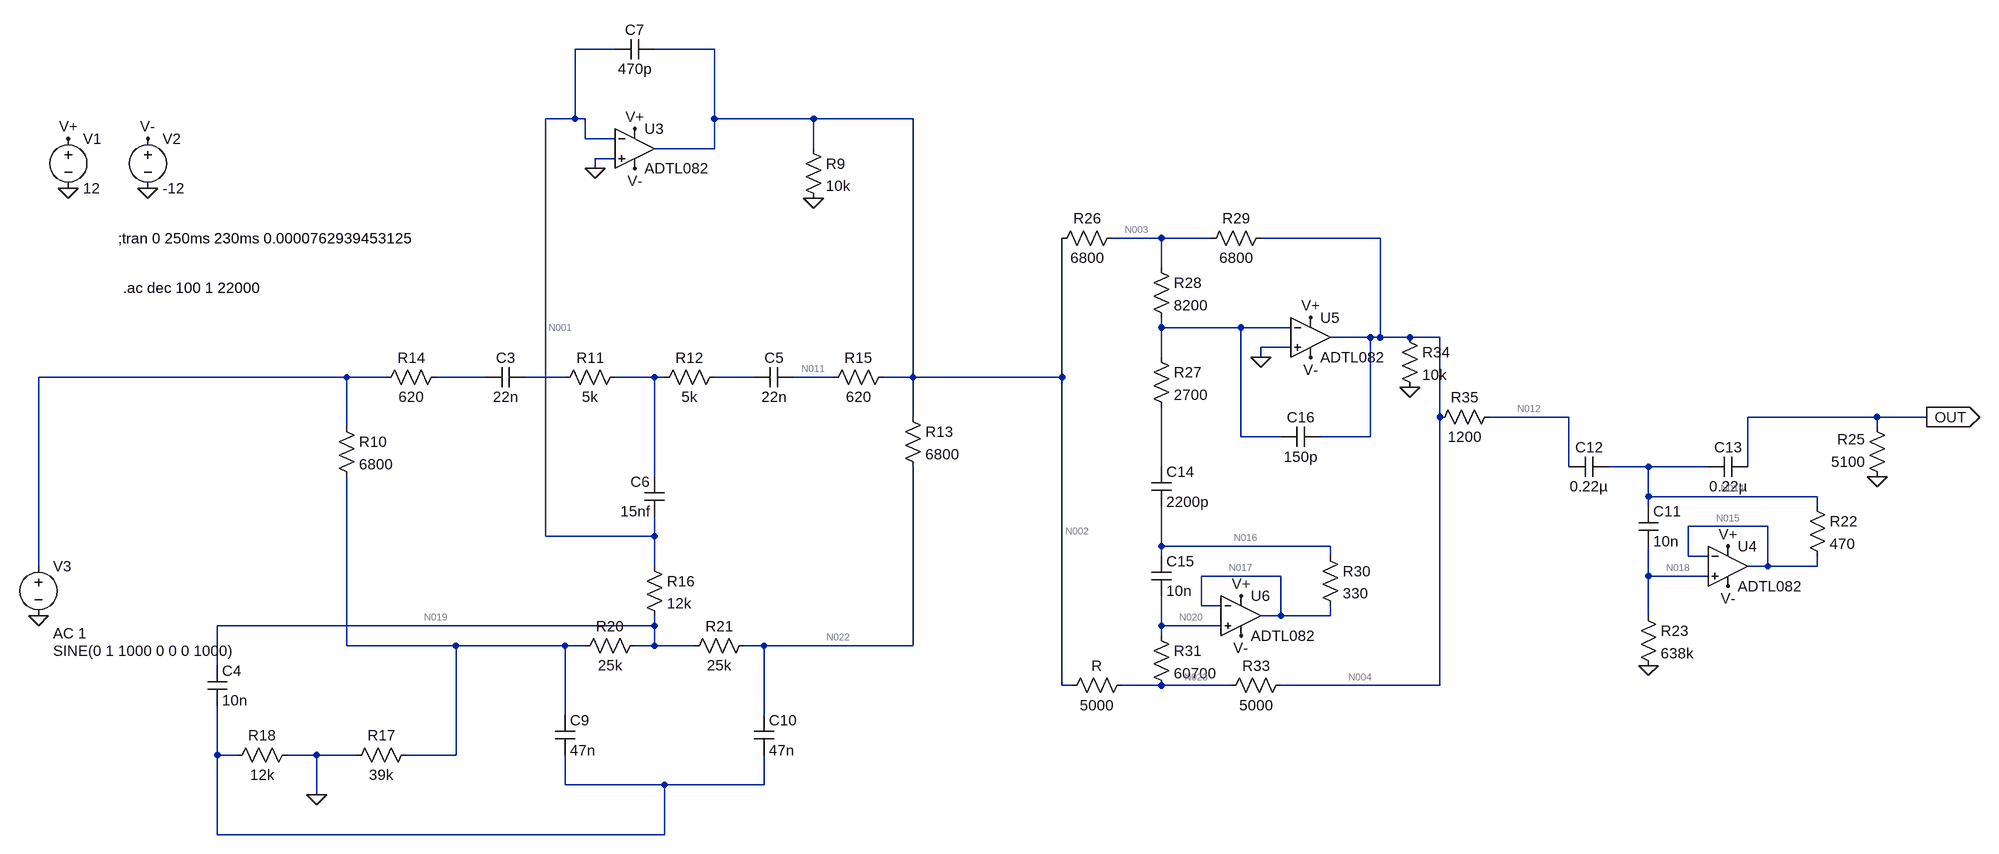
[diagram p0: schematic NYAN_1073.asc]
NYAN_1073.asc, the LTspice schematic file:
Version 4
SHEET 1 1724 2576
WIRE -1136 -144 -1200 -144
WIRE -976 -144 -1072 -144
WIRE -1200 -32 -1200 -144
WIRE -1200 -32 -1248 -32
WIRE -1184 -32 -1200 -32
WIRE -976 -32 -976 -144
WIRE -816 -32 -976 -32
WIRE -656 -32 -816 -32
WIRE -1184 0 -1184 -32
WIRE -1136 0 -1184 0
WIRE -976 16 -976 -32
WIRE -976 16 -1072 16
WIRE -816 16 -816 -32
WIRE -1136 32 -1168 32
WIRE -1168 48 -1168 32
WIRE -256 160 -336 160
WIRE -176 160 -256 160
WIRE 96 160 -96 160
WIRE -256 208 -256 160
WIRE -256 304 -256 288
WIRE -128 304 -256 304
WIRE -48 304 -128 304
WIRE 80 320 16 320
WIRE 96 320 96 160
WIRE 96 320 80 320
WIRE 144 320 96 320
WIRE 192 320 144 320
WIRE -48 336 -96 336
WIRE -256 352 -256 304
WIRE -96 352 -96 336
WIRE -1568 384 -2064 384
WIRE -1504 384 -1568 384
WIRE -1344 384 -1424 384
WIRE -1216 384 -1280 384
WIRE -1072 384 -1136 384
WIRE -1056 384 -1072 384
WIRE -912 384 -976 384
WIRE -784 384 -848 384
WIRE -656 384 -656 -32
WIRE -656 384 -704 384
WIRE -416 384 -416 160
WIRE -416 384 -656 384
WIRE -656 448 -656 384
WIRE 192 448 192 320
WIRE 400 448 272 448
WIRE 896 448 688 448
WIRE 976 448 896 448
WIRE -1568 464 -1568 384
WIRE 896 464 896 448
WIRE -128 480 -128 304
WIRE -64 480 -128 480
WIRE 80 480 80 320
WIRE 80 480 0 480
WIRE -256 528 -256 432
WIRE 400 528 400 448
WIRE 528 528 464 528
WIRE 624 528 528 528
WIRE 688 528 688 448
WIRE -1072 544 -1072 384
WIRE 528 576 528 528
WIRE 800 576 528 576
WIRE 528 592 528 576
WIRE 800 592 800 576
WIRE 720 624 592 624
WIRE -1248 640 -1248 -32
WIRE -1072 640 -1072 608
WIRE -1072 640 -1248 640
WIRE -256 656 -256 592
WIRE 16 656 -256 656
WIRE -256 672 -256 656
WIRE 16 672 16 656
WIRE 592 672 592 624
WIRE 624 672 592 672
WIRE -2064 688 -2064 384
WIRE -1072 688 -1072 640
WIRE 720 688 720 624
WIRE 720 688 688 688
WIRE 800 688 800 672
WIRE 800 688 720 688
WIRE -64 704 -192 704
WIRE 528 704 528 656
WIRE 624 704 528 704
WIRE -192 752 -192 704
WIRE -160 752 -192 752
WIRE -64 768 -64 704
WIRE -64 768 -96 768
WIRE 16 768 16 752
WIRE 16 768 -64 768
WIRE 528 768 528 704
WIRE -1072 784 -1072 768
WIRE -1072 784 -1776 784
WIRE -256 784 -256 736
WIRE -160 784 -256 784
WIRE -256 800 -256 784
WIRE -1568 816 -1568 544
WIRE -1392 816 -1568 816
WIRE -1216 816 -1392 816
WIRE -1184 816 -1216 816
WIRE -1072 816 -1072 784
WIRE -1072 816 -1104 816
WIRE -1008 816 -1072 816
WIRE -896 816 -928 816
WIRE -656 816 -656 528
WIRE -656 816 -896 816
WIRE -1776 848 -1776 784
WIRE -416 880 -416 384
WIRE -400 880 -416 880
WIRE -256 880 -320 880
WIRE -144 880 -256 880
WIRE 192 880 192 448
WIRE 192 880 -64 880
WIRE -1216 928 -1216 816
WIRE -896 928 -896 816
WIRE -1776 992 -1776 912
WIRE -1744 992 -1776 992
WIRE -1616 992 -1664 992
WIRE -1552 992 -1616 992
WIRE -1392 992 -1392 816
WIRE -1392 992 -1472 992
WIRE -1216 1040 -1216 992
WIRE -1056 1040 -1216 1040
WIRE -896 1040 -896 992
WIRE -896 1040 -1056 1040
WIRE -1616 1056 -1616 992
WIRE -1776 1120 -1776 992
WIRE -1056 1120 -1056 1040
WIRE -1056 1120 -1776 1120
FLAG -2016 80 0
FLAG 976 448 OUT
IOPIN 976 448 Out
FLAG -2016 0 V+
FLAG -1888 80 0
FLAG -1888 0 V-
FLAG -2064 768 0
FLAG -1168 48 0
FLAG -1104 -16 V+
FLAG -1104 48 V-
FLAG -1616 1056 0
FLAG -816 96 0
FLAG 656 656 V+
FLAG 656 720 V-
FLAG 528 848 0
FLAG 896 544 0
FLAG -96 352 0
FLAG -16 288 V+
FLAG -128 736 V+
FLAG -16 352 V-
FLAG -128 800 V-
FLAG 144 400 0
SYMBOL voltage -2016 -16 R0
WINDOW 123 0 0 Left 0
WINDOW 39 0 0 Left 0
SYMATTR InstName V1
SYMATTR Value 12
SYMBOL voltage -1888 -16 R0
WINDOW 123 0 0 Left 0
WINDOW 39 0 0 Left 0
SYMATTR InstName V2
SYMATTR Value -12
SYMBOL voltage -2064 672 R0
WINDOW 3 24 152 Left 2
WINDOW 123 24 124 Left 2
WINDOW 39 0 0 Left 0
SYMATTR Value SINE(0 1 1000 0 0 0 1000)
SYMATTR Value2 AC 1
SYMATTR InstName V3
SYMBOL res -1120 368 R90
WINDOW 0 0 56 VBottom 2
WINDOW 3 32 56 VTop 2
SYMATTR InstName R11
SYMATTR Value 5k
SYMBOL res -960 368 R90
WINDOW 0 0 56 VBottom 2
WINDOW 3 32 56 VTop 2
SYMATTR InstName R12
SYMATTR Value 5k
SYMBOL Opamps\\ADTL082 -1104 -48 R0
SYMATTR InstName U3
SYMBOL cap -1280 368 R90
WINDOW 0 0 32 VBottom 2
WINDOW 3 32 32 VTop 2
SYMATTR InstName C3
SYMATTR Value 22n
SYMBOL cap -848 368 R90
WINDOW 0 0 32 VBottom 2
WINDOW 3 32 32 VTop 2
SYMATTR InstName C5
SYMATTR Value 22n
SYMBOL cap -1056 608 R180
WINDOW 0 24 56 Left 2
WINDOW 3 24 8 Left 2
SYMATTR InstName C6
SYMATTR Value 15nf
SYMBOL res -1584 448 R0
SYMATTR InstName R10
SYMATTR Value 6800
SYMATTR SpiceLine tol=1 pwr=0.25
SYMBOL res -672 432 R0
SYMATTR InstName R13
SYMATTR Value 6800
SYMBOL res -1408 368 R90
WINDOW 0 0 56 VBottom 2
WINDOW 3 32 56 VTop 2
SYMATTR InstName R14
SYMATTR Value 620
SYMBOL res -688 368 R90
WINDOW 0 0 56 VBottom 2
WINDOW 3 32 56 VTop 2
SYMATTR InstName R15
SYMATTR Value 620
SYMBOL res -1088 672 R0
SYMATTR InstName R16
SYMATTR Value 12k
SYMBOL res -1456 976 R90
WINDOW 0 0 56 VBottom 2
WINDOW 3 32 56 VTop 2
SYMATTR InstName R17
SYMATTR Value 39k
SYMBOL res -1648 976 R90
WINDOW 0 0 56 VBottom 2
WINDOW 3 32 56 VTop 2
SYMATTR InstName R18
SYMATTR Value 12k
SYMBOL cap -1792 848 R0
SYMATTR InstName C4
SYMATTR Value 10n
SYMBOL cap -1072 -160 R90
WINDOW 0 0 32 VBottom 2
WINDOW 3 32 32 VTop 2
SYMATTR InstName C7
SYMATTR Value 470p
SYMBOL res -832 0 R0
SYMATTR InstName R9
SYMATTR Value 10k
SYMBOL res -1088 800 R90
WINDOW 0 0 56 VBottom 2
WINDOW 3 32 56 VTop 2
SYMATTR InstName R20
SYMATTR Value 25k
SYMBOL res -912 800 R90
WINDOW 0 0 56 VBottom 2
WINDOW 3 32 56 VTop 2
SYMATTR InstName R21
SYMATTR Value 25k
SYMBOL cap -1232 928 R0
SYMATTR InstName C9
SYMATTR Value 47n
SYMBOL cap -912 928 R0
SYMATTR InstName C10
SYMATTR Value 47n
SYMBOL Opamps\\ADTL082 656 624 R0
SYMATTR InstName U4
SYMBOL cap 512 592 R0
SYMATTR InstName C11
SYMATTR Value 10n
SYMATTR SpiceLine V=63
SYMBOL res 784 576 R0
SYMATTR InstName R22
SYMATTR Value 470
SYMATTR SpiceLine tol=1 pwr=0.25
SYMBOL res 512 752 R0
SYMATTR InstName R23
SYMATTR Value 638k
SYMATTR SpiceLine tol=1 pwr=0.25
SYMBOL res 912 560 R180
WINDOW 0 36 76 Left 2
WINDOW 3 36 40 Left 2
SYMATTR InstName R25
SYMATTR Value 5100
SYMBOL cap 464 512 R90
WINDOW 0 0 32 VBottom 2
WINDOW 3 32 32 VTop 2
SYMATTR InstName C12
SYMATTR Value 0.22µ
SYMBOL cap 688 512 R90
WINDOW 0 0 32 VBottom 2
WINDOW 3 32 32 VTop 2
SYMATTR InstName C13
SYMATTR Value 0.22µ
SYMBOL Opamps\\ADTL082 -16 256 R0
SYMATTR InstName U5
SYMBOL Opamps\\ADTL082 -128 704 R0
SYMATTR InstName U6
SYMBOL res -320 144 R90
WINDOW 0 0 56 VBottom 2
WINDOW 3 32 56 VTop 2
SYMATTR InstName R26
SYMATTR Value 6800
SYMATTR SpiceLine tol=1 pwr=0.25
SYMBOL res -272 336 R0
SYMATTR InstName R27
SYMATTR Value 2700
SYMATTR SpiceLine tol=1 pwr=0.25
SYMBOL res -272 192 R0
SYMATTR InstName R28
SYMATTR Value 8200
SYMATTR SpiceLine tol=1 pwr=0.25
SYMBOL cap -272 528 R0
SYMATTR InstName C14
SYMATTR Value 2200p
SYMATTR SpiceLine V=63
SYMBOL cap -272 672 R0
SYMATTR InstName C15
SYMATTR Value 10n
SYMATTR SpiceLine V=63
SYMBOL res -80 144 R90
WINDOW 0 0 56 VBottom 2
WINDOW 3 32 56 VTop 2
SYMATTR InstName R29
SYMATTR Value 6800
SYMATTR SpiceLine tol=1 pwr=0.25
SYMBOL res 0 656 R0
SYMATTR InstName R30
SYMATTR Value 330
SYMATTR SpiceLine tol=1 pwr=0.25
SYMBOL res -272 784 R0
SYMATTR InstName R31
SYMATTR Value 60700
SYMATTR SpiceLine tol=1 pwr=0.25
SYMBOL res -304 864 R90
WINDOW 0 0 56 VBottom 2
WINDOW 3 32 56 VTop 2
SYMATTR InstName R
SYMATTR Value 5000
SYMATTR SpiceLine tol=1 pwr=0.25
SYMBOL res -48 864 R90
WINDOW 0 0 56 VBottom 2
WINDOW 3 32 56 VTop 2
SYMATTR InstName R33
SYMATTR Value 5000
SYMATTR SpiceLine tol=1 pwr=0.25
SYMBOL res 128 304 R0
SYMATTR InstName R34
SYMATTR Value 10k
SYMBOL cap 0 464 R90
WINDOW 0 0 32 VBottom 2
WINDOW 3 32 32 VTop 2
SYMATTR InstName C16
SYMATTR Value 150p
SYMBOL res 288 432 R90
WINDOW 0 0 56 VBottom 2
WINDOW 3 32 56 VTop 2
SYMATTR InstName R35
SYMATTR Value 1200
TEXT -1928 240 Left 2 !.ac dec 100 1 22000
TEXT -1936 160 Left 2 !;tran 0 250ms 230ms 0.0000762939453125

The netlist it stands for:
* NYAN_1073.asc
V1 V+ 0 12
V2 V- 0 -12
V3 N006 0 SINE(0 1 1000 0 0 0 1000) AC 1
R11 N009 N008 5k
R12 N010 N009 5k
XU3 0 N001 V+ V- N002 ADTL082  ; pins In+ In- V+ V- OUT
C3 N008 N007 22n
C5 N011 N010 22n
C6 N001 N009 15nf
R10 N006 N021 6800 tol=1 pwr=0.25
R13 N002 N022 6800
R14 N007 N006 620
R15 N002 N011 620
R16 N001 N019 12k
R17 N021 0 39k
R18 0 N024 12k
C4 N019 N024 10n
C7 N002 N001 470p
R9 N002 0 10k
R20 N019 N021 25k
R21 N022 N019 25k
C9 N021 N024 47n
C10 N022 N024 47n
XU4 N018 N015 V+ V- N015 ADTL082  ; pins In+ In- V+ V- OUT
C11 N014 N018 10n V=63
R22 N014 N015 470 tol=1 pwr=0.25
R23 N018 0 638k tol=1 pwr=0.25
R25 0 OUT 5100
C12 N014 N012 0.22µ
C13 OUT N014 0.22µ
XU5 0 N005 V+ V- N004 ADTL082  ; pins In+ In- V+ V- OUT
XU6 N020 N017 V+ V- N017 ADTL082  ; pins In+ In- V+ V- OUT
R26 N003 N002 6800 tol=1 pwr=0.25
R27 N005 N013 2700 tol=1 pwr=0.25
R28 N003 N005 8200 tol=1 pwr=0.25
C14 N013 N016 2200p V=63
C15 N016 N020 10n V=63
R29 N004 N003 6800 tol=1 pwr=0.25
R30 N016 N017 330 tol=1 pwr=0.25
R31 N020 N023 60700 tol=1 pwr=0.25
R N023 N002 5000 tol=1 pwr=0.25
R33 N004 N023 5000 tol=1 pwr=0.25
R34 N004 0 10k
C16 N004 N005 150p
R35 N012 N004 1200
.ac dec 100 1 22000
;tran 0 250ms 230ms 0.0000762939453125
.lib ADI.lib
.backanno
.end

* Results of the author's LTspice run, read from the files saved beside the schematic
* Operating Point, zero values left out:
*   V(v+) = 12 V
*   V(v-) = -12 V
*   V(n002) = 112.4 nV
*   V(n011) = 112.4 nV
*   V(n022) = 93.49 nV
*   V(n019) = 24 nV
*   V(n015) = -1.276 µV
*   V(n018) = -1.276 µV
*   V(n014) = -1.276 µV
*   V(n012) = -65.99 nV
*   V(n004) = -65.99 nV
*   V(n017) = -103.2 nV
*   V(n020) = -103.2 nV
*   V(n003) = 16.4 nV
*   V(n016) = -103.2 nV
*   V(n023) = 18.2 nV
*   I(R34) = -6.599 pA
*   I(R33) = -16.84 pA
*   I(R) = -18.84 pA
*   I(R31) = -2 pA
*   I(R29) = -12.12 pA
*   I(R28) = 2 pA
*   I(R26) = -14.12 pA
*   I(R23) = -2 pA
*   I(R21) = 2.779 pA
*   I(R9) = 11.24 pA
*   I(R16) = -2 pA
*   I(R13) = 2.779 pA
*   I(V2) = 20.22 mA
*   I(V1) = -20.22 mA
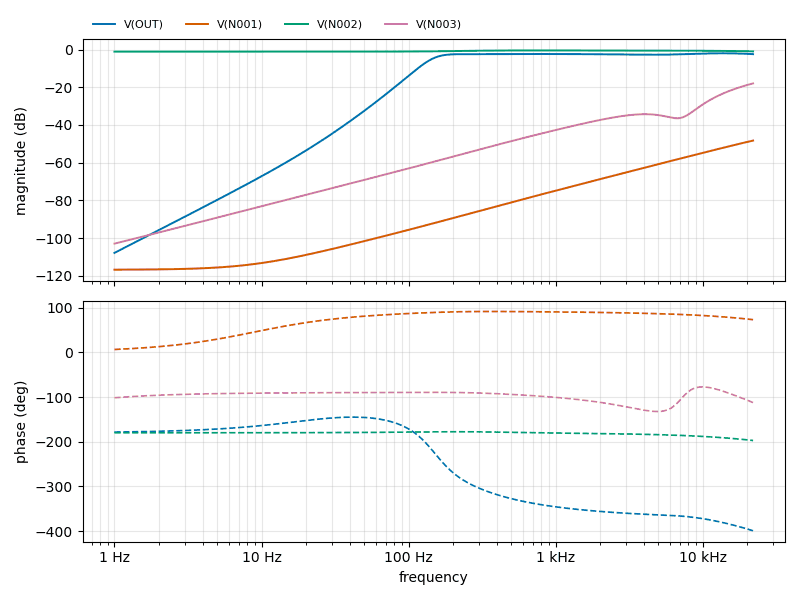
[diagram p1: AC Analysis of NYAN_1073.asc, plotted from the saved traces]
* AC Analysis, 1 run:
*   V(OUT): -107.89 dB at 1 Hz, -2.44 dB at 22 kHz, peak -1.98 dB at 13.49 kHz, 3 dB below the peak at 144.2 Hz
*   V(N001): -116.80 dB at 1 Hz, -48.29 dB at 22 kHz, peak -48.29 dB at 22 kHz, 3 dB below the peak at 15.18 kHz
*   V(N002): -1.12 dB at 1 Hz, -0.95 dB at 22 kHz, peak -0.45 dB at 707.9 Hz
*   V(N003): -102.97 dB at 1 Hz, -17.96 dB at 22 kHz, peak -17.96 dB at 22 kHz, 3 dB below the peak at 16.4 kHz